# Altium project first_rain_drone.PrjPcb
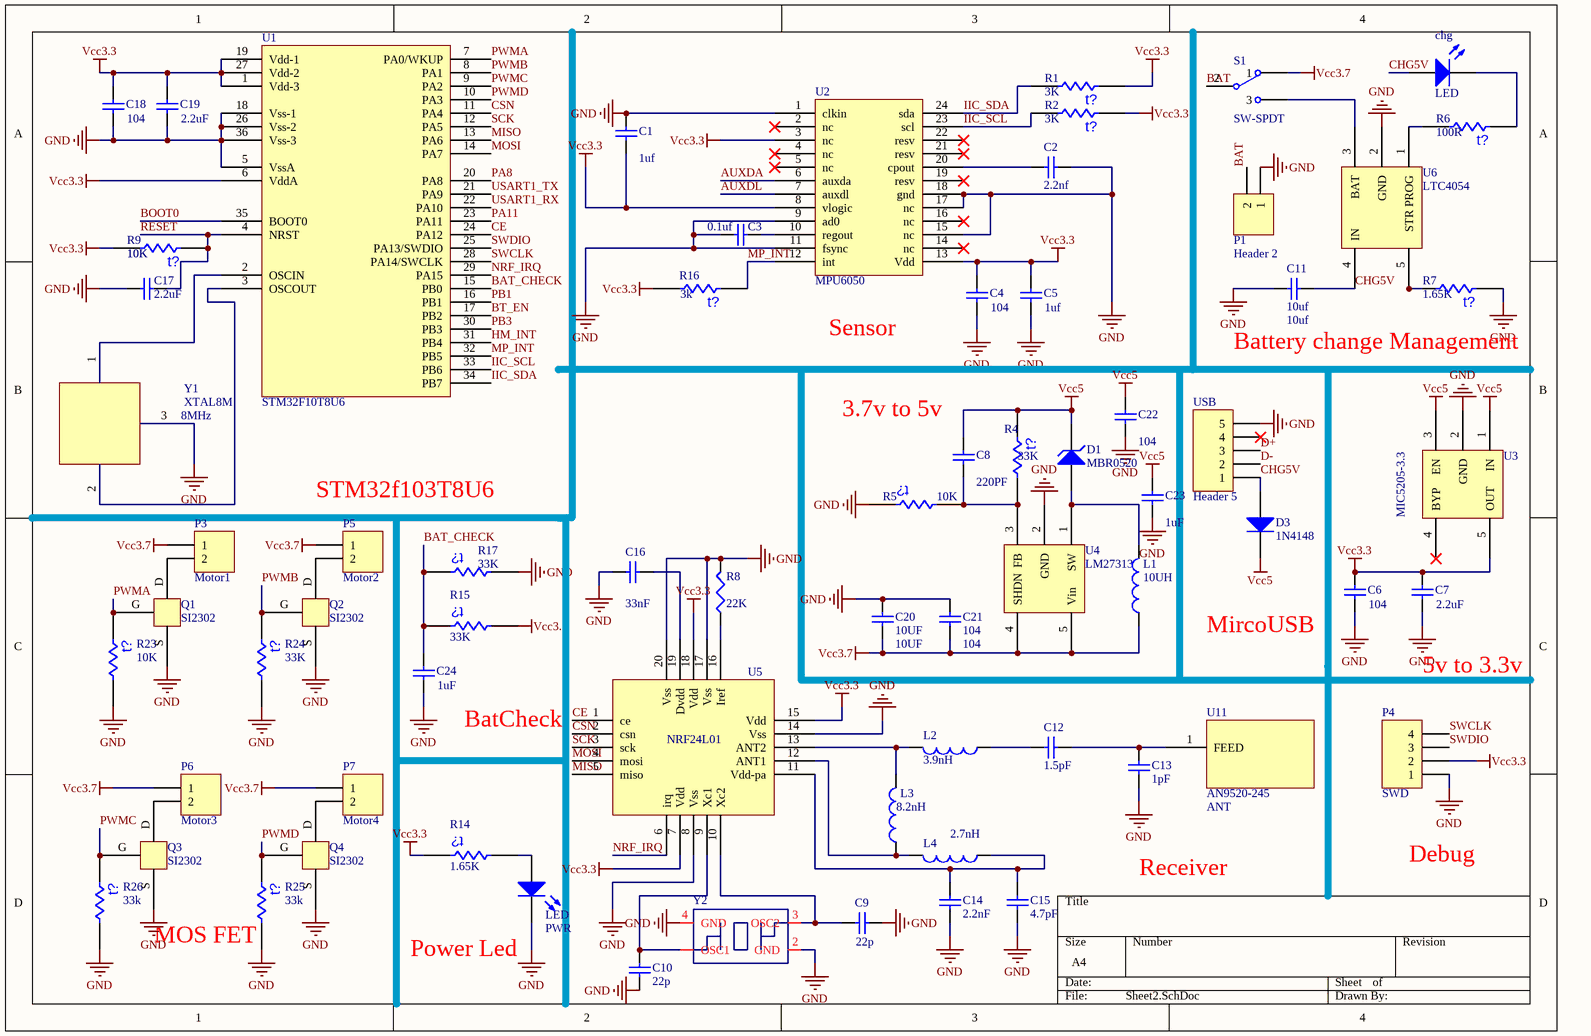
[diagram p0: Sheet2.SchDoc]
2 sheets, 98 parts. Net scope: global (net labels, ports and power ports of the same name join across sheets).
Board file: PCB2.PcbDoc
Sheets:
  Sheet2.SchDoc
  Sheet3.SchDoc

## Sheet Sheet2.SchDoc
size A4

### Parts
C1  1uf  [1608[0603]]
C2  2.2nf  [1608[0603]]
C3  0.1uf  [1608[0603]]
C4  104  [1608[0603]]
C5  1uf  [1608[0603]]
C6  104  [1608[0603]]
C7  2.2uF  [1608[0603]]
C8  220PF  [1608[0603]]
C9  22p  [1608[0603]]
C10  22p  [1608[0603]]
C11  10uf  [1608[0603]]
C12  1.5pF  [1608[0603]]
C13  1pF  [1608[0603]]
C14  2.2nF  [1608[0603]]
C15  4.7pF  [1608[0603]]
C16  33nF  [1608[0603]]
C17  2.2uF  [1608[0603]]
C18  104  [1608[0603]]
C19  2.2uF  [1608[0603]]
C20  10UF  [1608[0603]]
C21  104  [1608[0603]]
C22  104  [1608[0603]]
C23  1uF  [1608[0603]]
C24  1uF  [1608[0603]]
chg  LED  [6-0805_N]
D1  MBR0520  [CAPCP5113X06N]
D3  1N4148  [6-0805_N]
L1  10UH  [INDC3035X06N]
L2  3.9nH  [0805]
L3  8.2nH  [0805]
L4  2.7nH  [0805]
P1  Header 2  [HDR1X2]
P3  Motor1  [MHDR1X2]
P4  SWD  [HDR1X4]
P5  Motor2  [MHDR1X2]
P6  Motor3  [MHDR1X2]
P7  Motor4  [MHDR1X2]
PWR  LED  [6-0805_N]
Q1  SI2302  [SOT23_M]
Q2  SI2302  [SOT23_M]
Q3  SI2302  [SOT23_M]
Q4  SI2302  [SOT23_M]
R1  3K  [6-0805_N]
R2  3K  [6-0805_N]
R4  33K  [6-0805_N]
R5  10K  [6-0805_N]
R6  100R  [6-0805_N]
R7  1.65K  [6-0805_N]
R8  22K  [0805]
R9  10K  [6-0805_N]
R14  1.65K  [6-0805_N]
R15  33K  [6-0805_N]
R16  3k  [6-0805_N]
R17  33K  [6-0805_N]
R23  10K  [6-0805_N]
R24  33K  [6-0805_N]
R25  33k  [6-0805_N]
R26  33k  [6-0805_N]
S1  SW-SPDT  [HDR2X3]
U1  STM32F10T8U6  [stm32f1038tu6]
U2  MPU6050  [U8]
U3  MIC5205-3.3  [SOT95P280X120-5N]
U4  LM27313  [SOT95P280X120-5N]
U5  NRF24L01  [QFN-ML20_L]  (value not drawn)
U6  LTC4054  [SOT95P280X120-5N]
U11  ANT  [AN9520-245]
USB  Header 5  [USB_MICRO_B]
Y1  XTAL8M  value 8MHz  [CAPC1219X07N]
Y2  Component_1  [XTAL16MHz]  (value not drawn)

### Nets
GND: C1.2 C2.1 C3.2 C4.2 C5.2 C6.2 C7.2 C9.2 C10.1 C11.2 C13.1 C14.1 C15.1 C16.1 C17.1 C18.1 C19.1 C20.1 C21.1 C22.2 C23.2 C24.2 P1.1 P4.1 PWR.2(K) Q1.S Q2.S Q3.S Q4.S R5.1 R7.1 R8.2 R17.2 R23.2 R24.2 R25.2 R26.2 U1.5(VssA) U1.18(Vss-1) U1.26(Vss-2) U1.36(Vss-3) U2.1(clkin) U2.9(ad0) U2.11(fsync) U2.15(nc) U2.17(nc) U2.18(gnd) U3.2(GND) U4.2(GND) U5.8(Vss) U5.14(Vss) U5.17(Vss) U5.20(Vss) U6.2(GND) USB.5 Y1.3(PA18) Y2.2(GND) Y2.4(GND)
Vcc3.3: C1.1 C4.1 C5.1 C6.1 C7.1 C18.2 C19.2 P4.2 R1.1 R2.1 R9.2 R14.1 R16.2 U1.1(Vdd-3) U1.6(VddA) U1.19(Vdd-1) U1.27(Vdd-2) U2.3(nc) U2.8(vlogic) U2.13(Vdd) U3.5(OUT) U5.7(Vdd) U5.15(Vdd) U5.18(Vdd)
Vcc3.7: C20.2 C21.2 L1.1 P3.1 P5.1 P6.1 P7.1 R15.2 S1.1 U4.4(SHDN) U4.5(Vin)
Vcc5: C8.1 C22.1 C23.1 D1.2(K) D3.2(K) R4.1 U3.1(IN) U3.3(EN)
AUXDA: U2.6(auxda)
AUXDL: U2.7(auxdl)
BAT: P1.2 S1.2
BAT_CHECK: C24.1 R15.1 R17.1 U1.15(PB0)
BOOT0: U1.35(BOOT0)
BT_EN: U1.17(PB2)
CE: U1.24(PA12) U5.1(ce)
CHG5V: C11.1 chg.1(A) D3.1(A) U6.4(IN) USB.1
CSN: U1.11(PA4) U5.2(csn)
D+: USB.3
D-: USB.2
HM_INT: U1.31(PB4)
IIC_SCL: R2.2 U1.33(PB6) U2.23(scl)
IIC_SDA: R1.2 U1.34(PB7) U2.24(sda)
MISO: U1.13(PA6) U5.5(miso)
MOSI: U1.14(PA7) U5.4(mosi)
MP_INT: R16.1 U1.32(PB5) U2.12(int)
NRF_IRQ: U1.29(PA15) U5.6(irq)
PA8: U1.20(PA8)
PA11: U1.23(PA11)
PB1: U1.16(PB1)
PB3: U1.30(PB3)
PWMA: Q1.G R23.1 U1.7(PA0/WKUP)
PWMB: Q2.G R24.1 U1.8(PA1)
PWMC: Q3.G R26.1 U1.9(PA2)
PWMD: Q4.G R25.1 U1.10(PA3)
RESET: C17.2 R9.1 U1.4(NRST)
SCK: U1.12(PA5) U5.3(sck)
SWCLK: P4.4 U1.28(PA14/SWCLK)
SWDIO: P4.3 U1.25(PA13/SWDIO)
USART1_RX: U1.22(PA10)
USART1_TX: U1.21(PA9)
NetC2_2: C2.2 U2.20(cpout)
NetC3_1: C3.1 U2.10(regout)
NetC8_2: C8.2 R4.2 R5.2 U4.3(FB)
NetC9_1: C9.1 U5.10(Xc2) Y2.3(OSC2)
NetC10_2: C10.2 U5.9(Xc1) Y2.1(OSC1)
NetC12_1: C12.1 C13.2 U11.1(FEED)
NetC12_2: C12.2 L2.1
NetC14_2: C14.2 C15.2 L4.1 U5.11(Vdd-pa)
NetC16_2: C16.2 U5.19(Dvdd)
Netchg_2: chg.2(K) R6.1
NetD1_1: D1.1(A) L1.2 U4.1(SW)
NetL2_2: L2.2 L3.2 U5.13(ANT2)
NetL3_1: L3.1 L4.2 U5.12(ANT1)
NetP3_2: P3.2 Q1.D
NetP5_2: P5.2 Q2.D
NetP6_2: P6.2 Q3.D
NetP7_2: P7.2 Q4.D
NetPWR_1: PWR.1(A) R14.2
NetR6_2: R6.2 U6.1(STR_PROG)
NetR7_2: R7.2 U6.5
NetR8_1: R8.1 U5.16(Iref)
NetS1_3: S1.3 U6.3(BAT)
NetU1_2: U1.2(OSCIN) Y1.1(PA16)
NetU1_3: U1.3(OSCOUT) Y1.2(PA17)

Not connected (* = marked no-connect by the designer): U2 2(nc)* 4(nc)* 5(nc)* 14(nc)* 16(nc)* 19(resv)* 21(resv)* 22(resv)*; U3 4(BYP)*; USB 4*

### Notes on the sheet
- Labels drawn without touching a wire or pin: 3.7v to 5v, 5v to 3.3v, BatCheck, Battery change Management, Debug, MircoUSB, MOS FET, Power Led, Receiver, Sensor, STM32f103T8U6
- (in symbol Component_1) AN9520-245
- (in symbol Res Thermal) t?

### Library data of the parts
C1-C24 = Cap Semi: Capacitor (Semiconductor SIM Model); Published: 8-Jun-2000; LatestRevisionDate: 29-May-2009; LatestRevisionNote: IPC-7351 Footprint Added.; PackageReference: C1206; Publisher: Altium Limited; PackageDescription: Chip Capacitor
  C1 C5: Value: 1uf
  C2: Value: 2.2nf
  C3: Value: 0.1uf
  C4 C6 C18 C21 C22: Value: 104
  C7 C17 C19: Value: 2.2uF
  C8: Value: 220PF
  C9 C10: Value: 22p
  C11: Value: 10uf
  C12: Value: 1.5pF
  C13: Value: 1pF
  C14: Value: 2.2nF
  C15: Value: 4.7pF
  C16: Value: 33nF
  C20: Value: 10UF
  C23 C24: Value: 1uF
chg PWR = LED2: Typical RED, GREEN, YELLOW, AMBER GaAs LED; Published: 8-Jun-2000; LatestRevisionDate: 17-Jul-2002; LatestRevisionNote: Re-released for DXP Platform.; PackageVersion: Feb-2002; PackageReference: 3.2X1.6X1.1; Publisher: Altium Limited; PackageDescription: SM LED; 2 Flat Leads
D1 = D Zener: Zener Diode; Published: 8-Jun-2000; LatestRevisionDate: 17-Jul-2002; LatestRevisionNote: Re-released for DXP Platform.; PackageReference: DIODE-0.7; Publisher: Altium Limited
D3 = Diode: Default Diode; Published: 8-Jun-2000; LatestRevisionDate: 17-Jul-2002; LatestRevisionNote: Re-released for DXP Platform.; PackageVersion: Sep-1996; PackageReference: SMC; Publisher: Altium Limited; PackageDescription: DO-214-AB/SMC; 2 C-Bend Leads; Body 7.9 x 5.9 mm, inc. leads (LxW); Code_JEDEC: DO-214-AB
L1-L4 = Inductor: Code_IEC: 1005; Published: 8-Jun-2000; PackageReference: 0402-A; Publisher: Altium Limited; Code_JEITA: 0402
  L1: LatestRevisionDate: 29-May-2009; LatestRevisionNote: IPC-7351 Footprint Added.; PackageDescription: Chip Inductor; Value: 10UH
  L2: LatestRevisionDate: 17-Jul-2002; LatestRevisionNote: Re-released for DXP Platform.; Value: 3.9nH
  L3: LatestRevisionDate: 17-Jul-2002; LatestRevisionNote: Re-released for DXP Platform.; Value: 8.2nH
  L4: LatestRevisionDate: 17-Jul-2002; LatestRevisionNote: Re-released for DXP Platform.; Value: 2.7nH
P1 = Header 2: Header, 2-Pin; LatestRevisionDate: 17-Jul-2002; LatestRevisionNote: Re-released for DXP Platform.; Publisher: Altium Limited
P3 P5-P7 = MHDR1X2: Header, 2-Pin; LatestRevisionDate: 17-Jul-2002; LatestRevisionNote: Re-released for DXP Platform.; Publisher: Altium Limited
P4 = Header 4: Header, 4-Pin; LatestRevisionDate: 17-Jul-2002; LatestRevisionNote: Re-released for DXP Platform.; Publisher: Altium Limited
Q1-Q4 = Component_1: pin to pad: D>1 G>3 S>2
R1 R2 R4-R7 R9 R14-R17 R23-R26 = Res Thermal: Published: 24-Mar-1999; LatestRevisionDate: 29-May-2009; LatestRevisionNote: IPC-7351 Footprint Added.; PackageVersion: Mar-2003; PackageReference: 6-0805; Publisher: Altium Limited; PackageDescription: Chip Resistor 0805 Case Size; Code_IPC: RESC2012
  R1 R2: value: 3K
  R4 R15 R17 R24: value: 33K
  R5 R9: value: 10K
  R7: value: 1.65K
  R14: value: 1.65k
  R16: value: 3k
  R23: value: 10k
  R25 R26: value: 33k
R8 = Res3: Resistor; Published: 8-Jun-2000; LatestRevisionDate: 04-Mar-2005; LatestRevisionNote: PCB Footprint replaced.; PackageReference: J1-0603; Publisher: Altium Limited; Value: 22K
S1 = SW-SPD: SPDT Subminiature Toggle Switch, Right Angle Mounting, Vertical Actuation; pin to pad: 1>2 2>4 3>6; Published: 24-Mar-1999; LatestRevisionDate: 17-Dec-2003; LatestRevisionNote: Schematic revised, PCB Footprint replaced.; DatasheetDocument: 05-Dec-2000; PackageReference: TL36WW15050; Publisher: Altium Limited; ComponentLink1Description: Manufacturer Link; ComponentLink1URL: http://www.apem.com
U5 U11 = Component_1
USB = Header 5: Header, 5-Pin; LatestRevisionDate: 17-Jul-2002; LatestRevisionNote: Re-released for DXP Platform.; Publisher: Altium Limited

## Sheet Sheet3.SchDoc
size A4
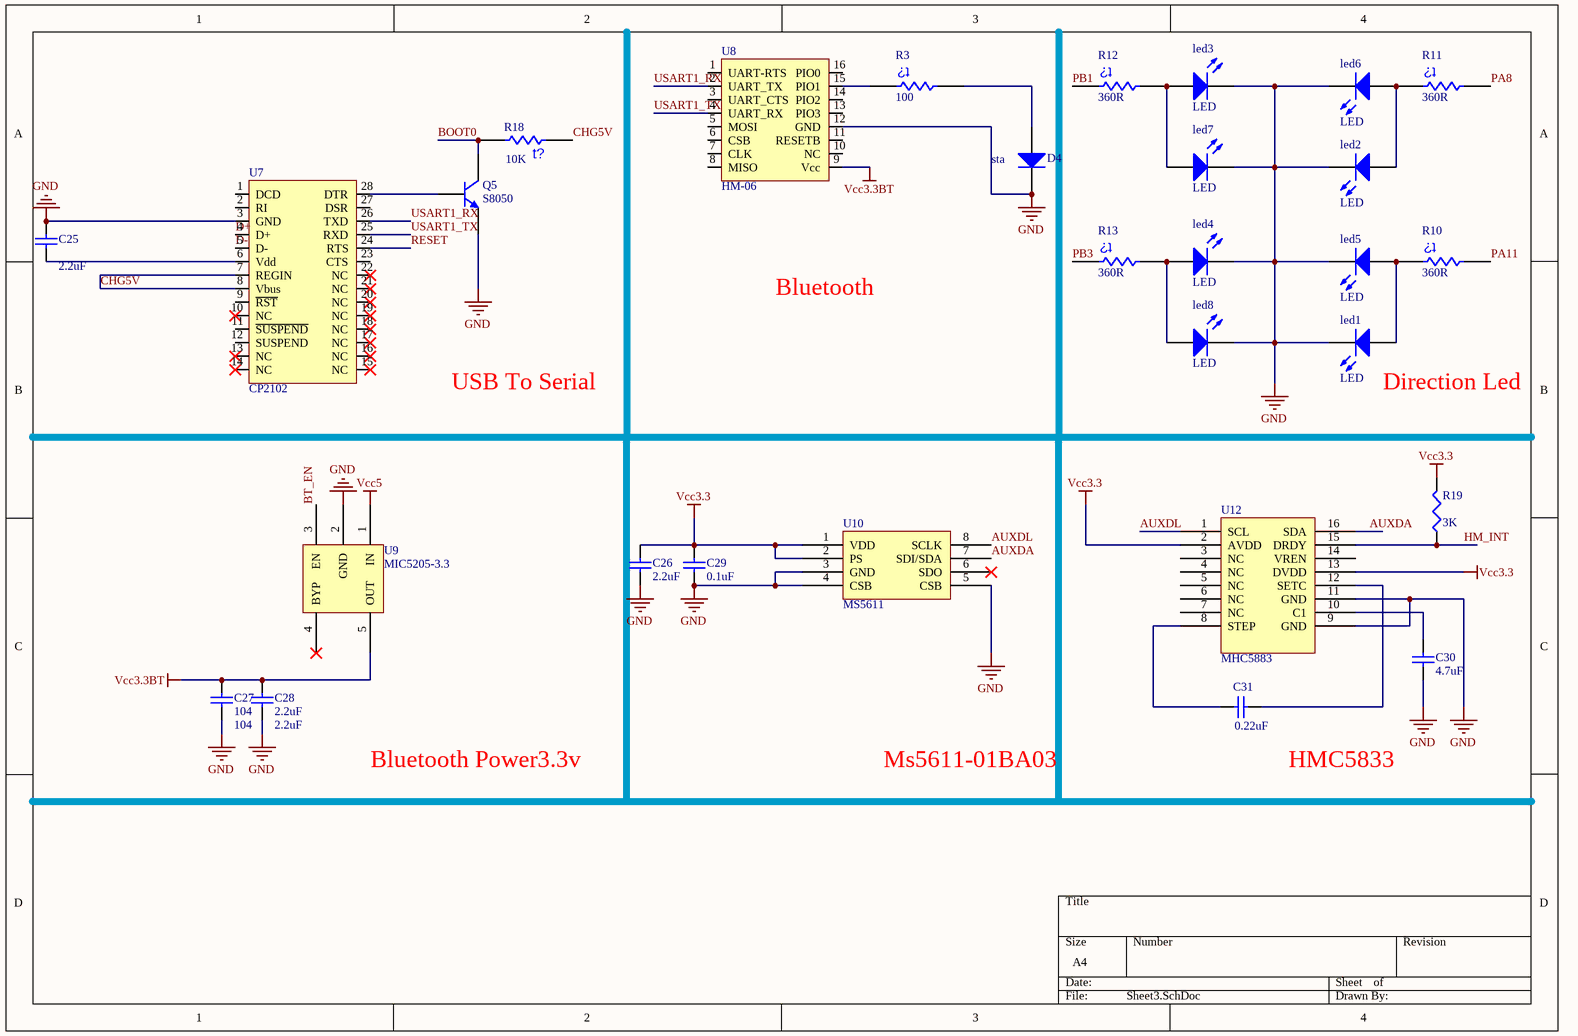
[diagram p1: Sheet3.SchDoc]

### Parts
C25  2.2uF  [1608[0603]]
C26  2.2uF  [1608[0603]]
C27  104  [1608[0603]]
C28  2.2uF  [1608[0603]]
C29  0.1uF  [1608[0603]]
C30  4.7uF  [1608[0603]]
C31  0.22uF  [1608[0603]]
D4  sta  [6-0805_N]
led1  LED  [6-0805_N]
led2  LED  [6-0805_N]
led3  LED  [6-0805_N]
led4  LED  [6-0805_N]
led5  LED  [6-0805_N]
led6  LED  [6-0805_N]
led7  LED  [6-0805_N]
led8  LED  [6-0805_N]
Q5  S8050  [SOT-23B_N]
R3  100  [6-0805_N]
R10  360R  [6-0805_N]
R11  360R  [6-0805_N]
R12  360R  [6-0805_N]
R13  360R  [6-0805_N]
R18  10K  [6-0805_N]
R19  3K  [0805]
U7  CP2102  [cp2102]
U8  HM-06  [HM-11]
U9  MIC5205-3.3  [SOT95P280X120-5N]
U10  MS5611  [U6 - duplicate1]  (value not drawn)
U12  HMC5833  [QFN50P302X302X90-16N]  (value not drawn)

### Nets
GND: C25.1 C26.1 C27.2 C28.2 C29.1 C30.1 D4.2(K) led1.2(K) led2.2(K) led3.2(K) led4.2(K) led5.2(K) led6.2(K) led7.2(K) led8.2(K) Q5.3(E) U7.3(GND) U8.12(GND) U9.2(GND) U10.3(GND) U10.4(CSB) U10.5(CSB) U12.9(GND) U12.11(GND)
Vcc3.3: C26.2 C29.2 R19.2 U10.1(VDD) U10.2(PS) U12.2(AVDD) U12.13(DVDD)
Vcc3.3BT: C27.1 C28.1 U8.9(Vcc) U9.5(OUT)
Vcc5: U9.1(IN)
AUXDA: U10.7(SDI/SDA) U12.16(SDA)
AUXDL: U10.8(SCLK) U12.1(SCL)
BOOT0: Q5.1(C) R18.2
BT_EN: U9.3(EN)
CHG5V: R18.1 U7.7(REGIN) U7.8(Vbus)
D+: U7.4(D+)
D-: U7.5(D-)
HM_INT: R19.1 U12.15(DRDY)
PA8: R11.2
PA11: R10.2
PB1: R12.1
PB3: R13.1
RESET: U7.24(RTS)
USART1_RX: U7.26(TXD) U8.2(UART_TX)
USART1_TX: U7.25(RXD) U8.4(UART_RX)
NetC25_2: C25.2 U7.6(Vdd)
NetC30_2: C30.2 U12.10(C1)
NetC31_1: C31.1 U12.8(STEP)
NetC31_2: C31.2 U12.12(SETC)
NetD4_1: D4.1(A) R3.2
Netled1_1: led1.1(A) led5.1(A) R10.1
Netled2_1: led2.1(A) led6.1(A) R11.1
Netled3_1: led3.1(A) led7.1(A) R12.2
Netled4_1: led4.1(A) led8.1(A) R13.2
NetQ5_2: Q5.2(B) U7.28(DTR)
NetR3_1: R3.1 U8.15(PIO1)

Not connected (* = marked no-connect by the designer): U7 1(DCD) 2(RI) 9(~{RST}) 10(NC)* 11(~{SUSPEND}) 12(SUSPEND) 13(NC)* 14(NC)* 15(NC)* 16(NC)* 17(NC)* 18(NC)* 19(NC)* 20(NC)* 21(NC)* 22(NC)* 23(CTS) 27(DSR); U8 1(UART-RTS) 3(UART_CTS) 5(MOSI) 6(CSB) 7(CLK) 8(MISO) 10(NC) 11(RESETB) 13(PIO3) 14(PIO2) 16(PIO0); U9 4(BYP)*; U10 6(SDO)*; U12 3(NC) 4(NC) 5(NC) 6(NC) 7(NC) 14(VREN)

### Notes on the sheet
- Labels drawn without touching a wire or pin: Bluetooth, Bluetooth Power3.3v, Direction Led, HMC5833, Ms5611-01BA03, USB To Serial
- (in symbol Component_1) MHC5883
- (in symbol Res Thermal) t?

### Library data of the parts
C25-C31 = Cap Semi: Capacitor (Semiconductor SIM Model); Published: 8-Jun-2000; LatestRevisionDate: 29-May-2009; LatestRevisionNote: IPC-7351 Footprint Added.; PackageReference: C1206; Publisher: Altium Limited; PackageDescription: Chip Capacitor
  C25 C26 C28: Value: 2.2uF
  C27: Value: 104
  C29: Value: 0.1uF
  C30: Value: 4.7uF
  C31: Value: 0.22uF
D4 = Diode: Default Diode; Published: 8-Jun-2000; LatestRevisionDate: 17-Jul-2002; LatestRevisionNote: Re-released for DXP Platform.; PackageVersion: Sep-1996; PackageReference: SMC; Publisher: Altium Limited; PackageDescription: DO-214-AB/SMC; 2 C-Bend Leads; Body 7.9 x 5.9 mm, inc. leads (LxW); Code_JEDEC: DO-214-AB
led1-led8 = LED2: as chg on sheet Sheet2; Published: 8-Jun-2000; LatestRevisionDate: 17-Jul-2002; LatestRevisionNote: Re-released for DXP Platform.; PackageVersion: Feb-2002; PackageReference: 3.2X1.6X1.1; Publisher: Altium Limited; PackageDescription: SM LED; 2 Flat Leads
Q5 = QNPN: NPN Bipolar Transistor; Published: 8-Jun-2000; LatestRevisionDate: 29-May-2009; LatestRevisionNote: IPC-7351 Footprint Added.; PackageVersion: Aug-1999; PackageReference: SOT-23B; Publisher: Altium Limited; PackageDescription: 3-Pin SOT-23 Package 0.95 mm Pitch, 2.4 mm Lead Span
R3 = Res Thermal: value: 100K; Published: 24-Mar-1999; LatestRevisionDate: 29-May-2009; LatestRevisionNote: IPC-7351 Footprint Added.; PackageVersion: Mar-2003; PackageReference: 6-0805; Publisher: Altium Limited; PackageDescription: Chip Resistor 0805 Case Size; Code_IPC: RESC2012
R10-R13 = Res Thermal: value: 360K; Published: 24-Mar-1999; LatestRevisionDate: 29-May-2009; LatestRevisionNote: IPC-7351 Footprint Added.; PackageVersion: Mar-2003; PackageReference: 6-0805; Publisher: Altium Limited; PackageDescription: Chip Resistor 0805 Case Size; Code_IPC: RESC2012
R18 = Res Thermal: Published: 24-Mar-1999; LatestRevisionDate: 29-May-2009; LatestRevisionNote: IPC-7351 Footprint Added.; PackageVersion: Mar-2003; PackageReference: 6-0805; Publisher: Altium Limited; PackageDescription: Chip Resistor 0805 Case Size; Code_IPC: RESC2012; value: 10K
R19 = Res3: Resistor; Published: 8-Jun-2000; LatestRevisionDate: 04-Mar-2005; LatestRevisionNote: PCB Footprint replaced.; PackageReference: J1-0603; Publisher: Altium Limited; Value: 3K
U8 = bluetooth
U10 U12 = Component_1

## Nets that join several sheets
GND: Sheet2 (58 pins), Sheet3 (24 pins)
Vcc3.3: Sheet2 (24 pins), Sheet3 (7 pins)
Vcc5: Sheet2 (8 pins), Sheet3 (U9.1)
AUXDA: Sheet2 (U2.6), Sheet3 (U10.7 U12.16)
AUXDL: Sheet2 (U2.7), Sheet3 (U10.8 U12.1)
BOOT0: Sheet2 (U1.35), Sheet3 (Q5.1 R18.2)
BT_EN: Sheet2 (U1.17), Sheet3 (U9.3)
CHG5V: Sheet2 (5 pins), Sheet3 (R18.1 U7.7 U7.8)
D+: Sheet2 (USB.3), Sheet3 (U7.4)
D-: Sheet2 (USB.2), Sheet3 (U7.5)
HM_INT: Sheet2 (U1.31), Sheet3 (R19.1 U12.15)
PA8: Sheet2 (U1.20), Sheet3 (R11.2)
PA11: Sheet2 (U1.23), Sheet3 (R10.2)
PB1: Sheet2 (U1.16), Sheet3 (R12.1)
PB3: Sheet2 (U1.30), Sheet3 (R13.1)
RESET: Sheet2 (C17.2 R9.1 U1.4), Sheet3 (U7.24)
USART1_RX: Sheet2 (U1.22), Sheet3 (U7.26 U8.2)
USART1_TX: Sheet2 (U1.21), Sheet3 (U7.25 U8.4)